# EAGLE design wifi_main_fix (EAGLE 8.7.1)
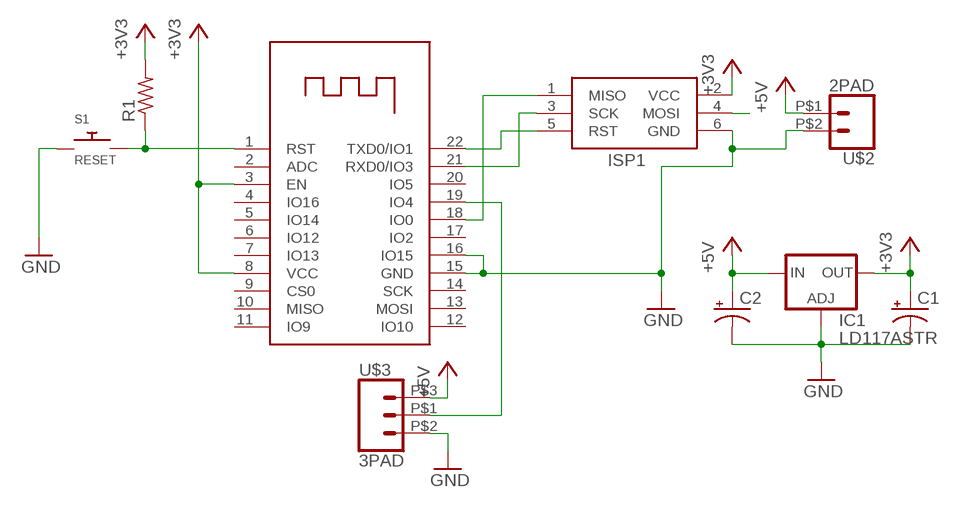
[diagram p0: schematic, sheet 1]

## Parts
C1  CPOL-US153CLV-0405  [153CLV-0405]
C2  CPOL-US153CLV-0405  [153CLV-0405]
IC1  LD117ASTR  [SOT223]
ISP1  AVRISP-6  [AVRISP]
R1  R-US_R0805  [R0805]
S1  RESET  BUTTON  [B3F-1000]
U$1  ESP-12F  [ESP-12F]
U$2  2PAD  [2PAD]
U$3  3PAD  [3PAD]

## Nets
+3V3: C1.+ IC1.4(OUT) ISP1.2(VCC) R1.2 U$1.3(EN) U$1.8(VCC)
+5V: C2.+ IC1.3(IN) U$2.P$1 U$3.P$3
GND: C1.- C2.- IC1.1(ADJ) ISP1.6(GND) S1.1 S1.2 U$1.15(GND) U$1.16(IO15) U$2.P$2 U$3.P$2
IO0: ISP1.1(MISO) U$1.18(IO0)
N$1: U$1.19(IO4) U$3.P$1
N$2: ISP1.4(MOSI)
N$5: R1.1 S1.3 S1.4 U$1.1(RST)
RX: ISP1.3(SCK) U$1.21(RXD0/IO3)
TX: ISP1.5(RST) U$1.22(TXD0/IO1)
Unconnected: U$1.2(ADC) U$1.4(IO16) U$1.5(IO14) U$1.6(IO12) U$1.7(IO13) U$1.9(CS0) U$1.10(MISO) U$1.11(IO9) U$1.12(IO10) U$1.13(MOSI) U$1.14(SCK) U$1.17(IO2) U$1.20(IO5)

## Library data of the parts
C1 C2 = resistor:CPOL-US: POLARIZED CAPACITOR, American symbol
IC1 = v-reg:LD117A?*: Low drop fixed and adjustable positive voltage regulators 1 A Source: http://www.st.com/stonline/products/literature/ds/7194/ld1117axx.pdf
ISP1 = my_parts:AVRISP: AVR ISP HEADER Standard 6 pin header for AVR programming
R1 = resistor:R-US_: RESISTOR, American symbol
S1 = my_parts:BUTTON
U$1 = my_parts:ESP-12F
U$2 = my_parts:2PAD
U$3 = my_parts:3PAD

## Board
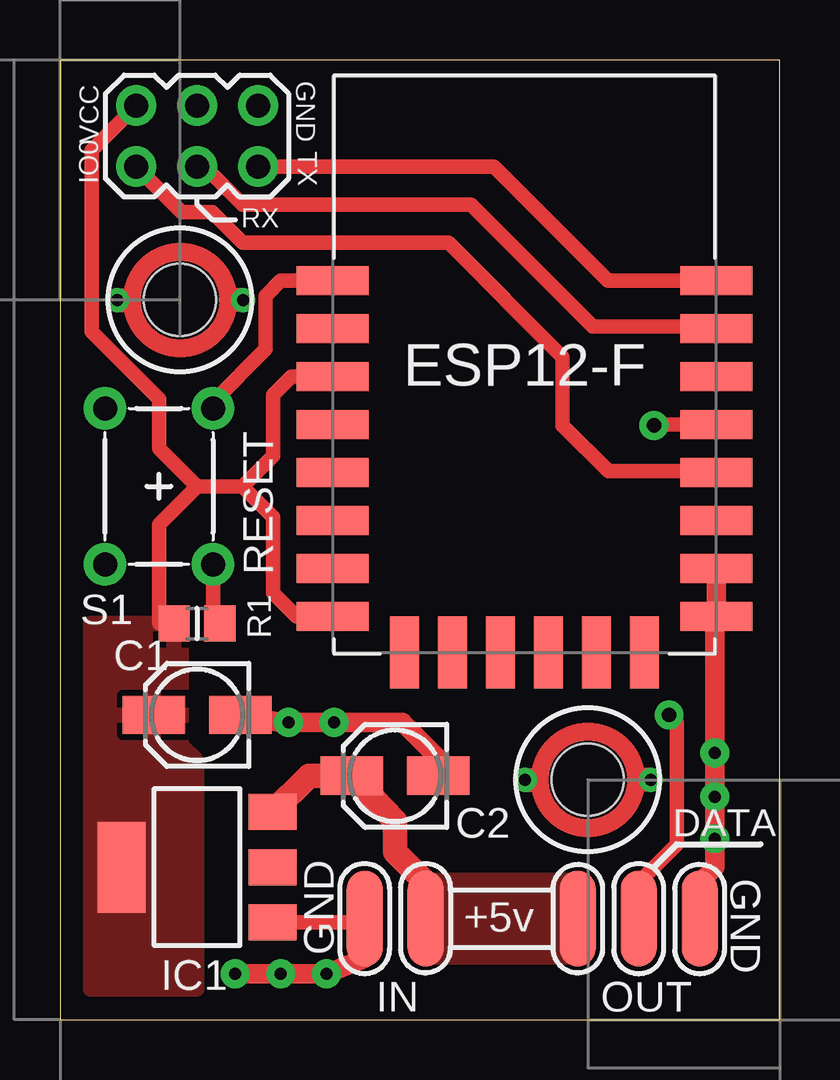
[diagram p1: board, top side]
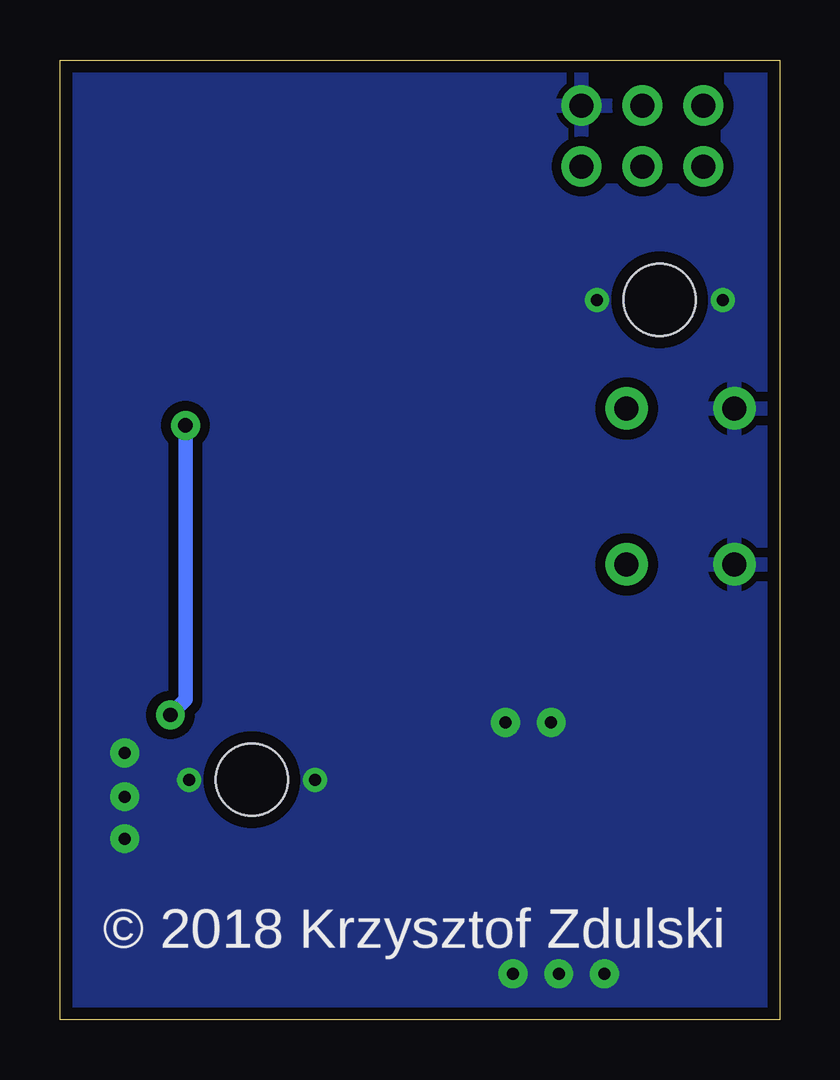
[diagram p2: board, bottom side, seen from below]

Size 30 x 40 mm. Coordinates in mm from the lower left corner, seen from the top.
Outline: 0,0 30,0 30,40 0,40 0,0
Copper layers (1*16): Top 0.035mm / dielectric 1.5mm / Bottom 0.035mm
Design rules "default *": minimum track width 6mil, minimum drill 0.35mm, track to track 6mil, track to pad 6mil, pad to pad 6mil, via to via 6mil, smd to smd 6mil, copper to edge 20mil, drill to drill 6mil, minimum pad ring 10mil, minimum via ring 4mil, stop-mask expansion 4mil, vias tented up to drill 30mil, thermal gap 10mil
Holes 3 mm at 5,30 22,10

### Footprints (pad centres in the part's own frame; a part is rotated, then mirrored left to right if it is on the bottom)
153CLV-0405 = smd 2.6 x 1.6: + 1.8,0; - -1.8,0
SOT223 = smd 1.5 x 2: 1 -2.3,-3.15; 2 0,-3.15; 3 2.3,-3.15 | smd 3.8 x 2: 4 0,3.15
AVRISP = drill 1 pad 1.676: 1 -1.27,2.54; 2 1.27,2.54; 3 -1.27,0; 4 1.27,0; 5 -1.27,-2.54; 6 1.27,-2.54
R0805 = smd 1.3 x 1.5: 1 -0.95,0; 2 0.95,0
B3F-1000 = drill 1 pad 1.778: 1 -3.25,2.25; 2 3.25,2.25; 3 -3.25,-2.25; 4 3.25,-2.25
ESP-12F = smd 3 x 1.2: 1 -8,3.5; 2 -8,1.5; 3 -8,-0.5; 4 -8,-2.5; 5 -8,-4.5; 6 -8,-6.5; 7 -8,-8.5; 8 -8,-10.5; 15 8,-10.5; 16 8,-8.5; 17 8,-6.5; 18 8,-4.5; 19 8,-2.5; 20 8,-0.5; 21 8,1.5; 22 8,3.5 | smd 1.2 x 3: 9 -5,-12; 10 -3,-12; 11 -1,-12; 12 1,-12; 13 3,-12; 14 5,-12
2PAD = smd 1.5 x 4: P$1 -1.27,0; P$2 1.27,0
3PAD = smd 1.5 x 4: P$1 0,0; P$2 -2.54,0; P$3 2.54,0

### Placement (x,y rotation side)
C1  5.71,12.7 180 top
C2  13.97,10.16 180 top
IC1  5.71,6.35 90 top
ISP1  5.71,36.83 90 top
R1  5.71,16.51 180 top
S1  4.13,22.23 90 top
U$1  19.37,27.3 0 top
U$2  13.97,4.21 180 top
U$3  24.13,4.21 180 top

### Tracks (layer width: path | path; a pad name or v marks a point on that pad's centre or on a via)
+3V3
  Top 0.61: 2.59,7.01 IC1.4 | U$1.3 9.66,26.8 8.89,26.04 8.89,23.5 7.62,22.23 | 7.62,22.23 8.89,20.95 8.89,17.78 9.87,16.8 U$1.8 | 7.62,22.23 5.71,22.23 | 5.71,22.23 4.13,20.64 4.13,16.51 | 5.71,22.23 4.13,23.81 4.13,25.87 1.32,28.68 1.32,36.25 ISP1.2
  pour Top (no thermals): 1.27,1.27 1.27,9.84 5.71,9.84 5.71,1.27
  pour Top: 1.27,9.84 5.71,9.84 5.71,10.79 5.08,11.43 5.08,16.51 1.27,16.51
+5V
  Top 1.016: IC1.3 10.38,10.16 C2.+ 13.97,8.27 13.97,6.98 15.24,5.71 U$2.P$1
  pour Top (no thermals): 15.24,5.95 21.59,5.95 21.59,2.46 15.24,2.46
GND  (via drill 0.5 pad 1, 0.5 pad 1.2)
  Top 0.61: IC1.1 12.87,4.05 U$2.P$2
  Top 0.813: U$2.P$2 12.71,2.54 v11.11,1.91 v9.21,1.91 v7.3,1.91 | U$3.P$2 26.67,5.71 27.3,6.35 v27.3,7.54 v27.3,9.29 v27.3,11.11 27.3,16.74 U$1.15 U$1.16 | C1.- 9.19,12.38 v9.53,12.38 v11.43,12.38 14.29,12.38 16.17,10.5
  Top 1: v19.38,10 19.88,10 | v24.62,10 24.12,10 | v7.62,30 7.12,30 | v2.38,30 2.88,30
  Top 1.016: 16.17,10.5 C2.-
  pour Bottom (isolate 0.406): 0,0 30,0 30,40 0,40
IO0
  Top 0.61: U$1.18 27.37,22.86 22.86,22.86 20.95,24.77 20.95,27.62 16.19,32.38 7.62,32.38 6.35,33.66 5.08,33.66 ISP1.1
N$1  (via drill 0.6 pad 1.2)
  Top 0.61: U$3.P$1 24.13,5.71 25.72,7.3 25.72,12.38 v25.4,12.7 | v24.77,24.77 24.8,24.8 U$1.19
  Bottom 0.61: v25.4,12.7 24.77,13.34 v24.77,24.77
N$5
  Top 0.61: R1.1 6.38,16.86 S1.3 | U$1.1 9.21,30.8 8.57,30.16 8.57,27.94 6.38,25.75 S1.4
RX
  Top 0.61: U$1.21 27.28,28.89 22.23,28.89 17.14,33.97 7.62,33.97 6.03,35.56 ISP1.3
TX
  Top 0.61: U$1.22 22.85,30.8 18.1,35.56 ISP1.5
(copper drawn outside any net)
  shapes: Top circle x2

### Text on the board
_tplace: VCC | GND | TX | IO0 | RX | ESP12-F | DATA | GND | +5v | GND | IN | OUT
_bplace: © 2018 Krzysztof Zdulski